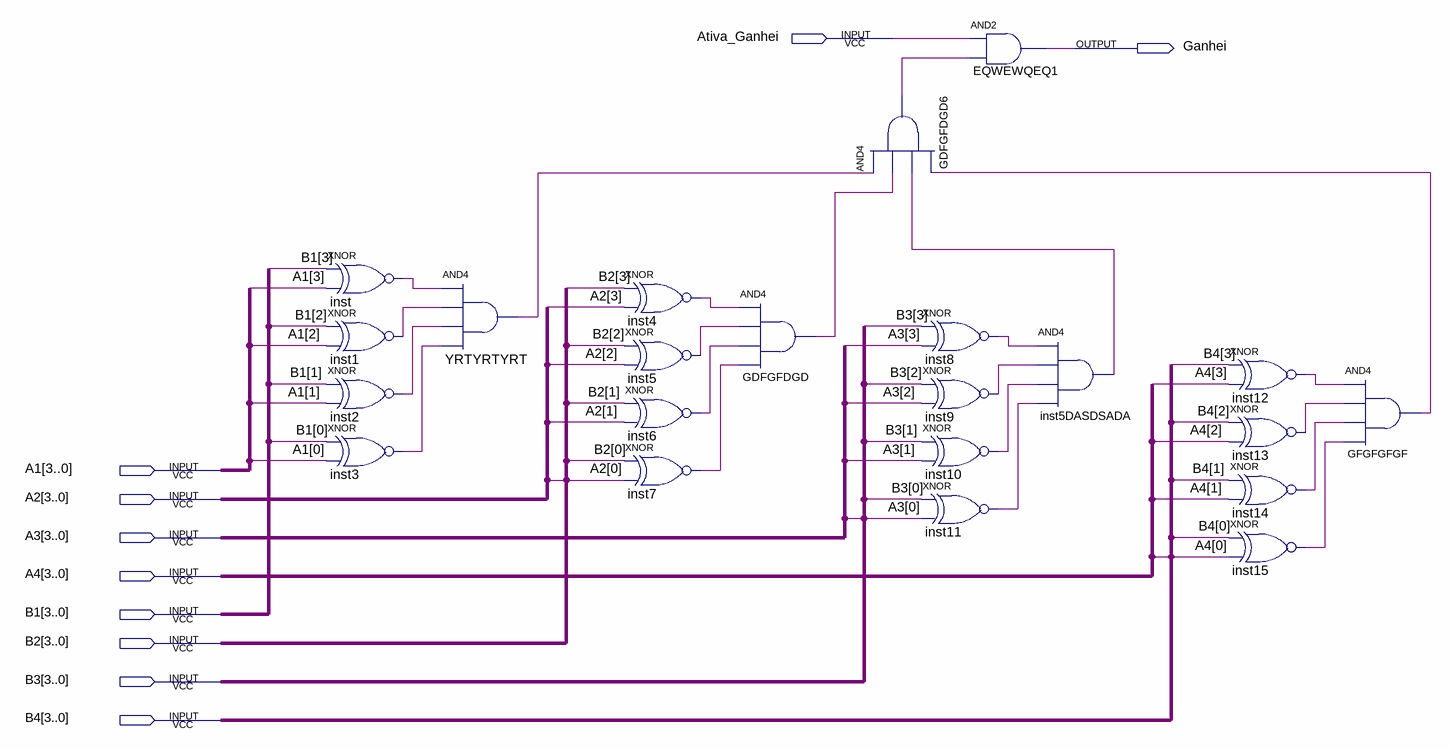
[diagram p0: schematic sheet]
// Quartus schematic Ganhei.bdf as structural Verilog: 22 symbols, 10 pins
module Ganhei (
  input  Ativa_Ganhei,
  input  [3:0] A1,
  input  [3:0] A2,
  input  [3:0] A3,
  input  [3:0] A4,
  input  [3:0] B1,
  input  [3:0] B2,
  input  [3:0] B3,
  input  [3:0] B4,
  output Ganhei
);

  wire GDFGFDGD6_out, GDFGFDGD_out, GFGFGFGF_out, inst1_out, inst2_out, inst3_out, inst4_out, inst5_out,
       inst5DASDSADA_out, inst6_out, inst7_out, inst8_out, inst9_out, inst10_out, inst11_out, inst12_out,
       inst13_out, inst14_out, inst15_out, inst_out, YRTYRTYRT_out;

  xnor inst (inst_out, B1[3], A1[3]);
  xnor inst1 (inst1_out, B1[2], A1[2]);
  xnor inst2 (inst2_out, B1[1], A1[1]);
  xnor inst3 (inst3_out, B1[0], A1[0]);
  and YRTYRTYRT (YRTYRTYRT_out, inst_out, inst1_out, inst2_out, inst3_out);
  xnor inst4 (inst4_out, B2[3], A2[3]);
  xnor inst5 (inst5_out, B2[2], A2[2]);
  xnor inst6 (inst6_out, B2[1], A2[1]);
  xnor inst7 (inst7_out, B2[0], A2[0]);
  and GDFGFDGD (GDFGFDGD_out, inst4_out, inst5_out, inst6_out, inst7_out);
  and GDFGFDGD6 (GDFGFDGD6_out, YRTYRTYRT_out, GDFGFDGD_out, inst5DASDSADA_out, GFGFGFGF_out);
  xnor inst8 (inst8_out, B3[3], A3[3]);
  xnor inst9 (inst9_out, B3[2], A3[2]);
  xnor inst10 (inst10_out, B3[1], A3[1]);
  xnor inst11 (inst11_out, B3[0], A3[0]);
  and EQWEWQEQ1 (Ganhei, Ativa_Ganhei, GDFGFDGD6_out);
  and inst5DASDSADA (inst5DASDSADA_out, inst8_out, inst9_out, inst10_out, inst11_out);
  xnor inst12 (inst12_out, B4[3], A4[3]);
  xnor inst13 (inst13_out, B4[2], A4[2]);
  xnor inst14 (inst14_out, B4[1], A4[1]);
  xnor inst15 (inst15_out, B4[0], A4[0]);
  and GFGFGFGF (GFGFGFGF_out, inst12_out, inst13_out, inst14_out, inst15_out);
endmodule
